# EAGLE design 6xLED_Panel (EAGLE 9.6.2)
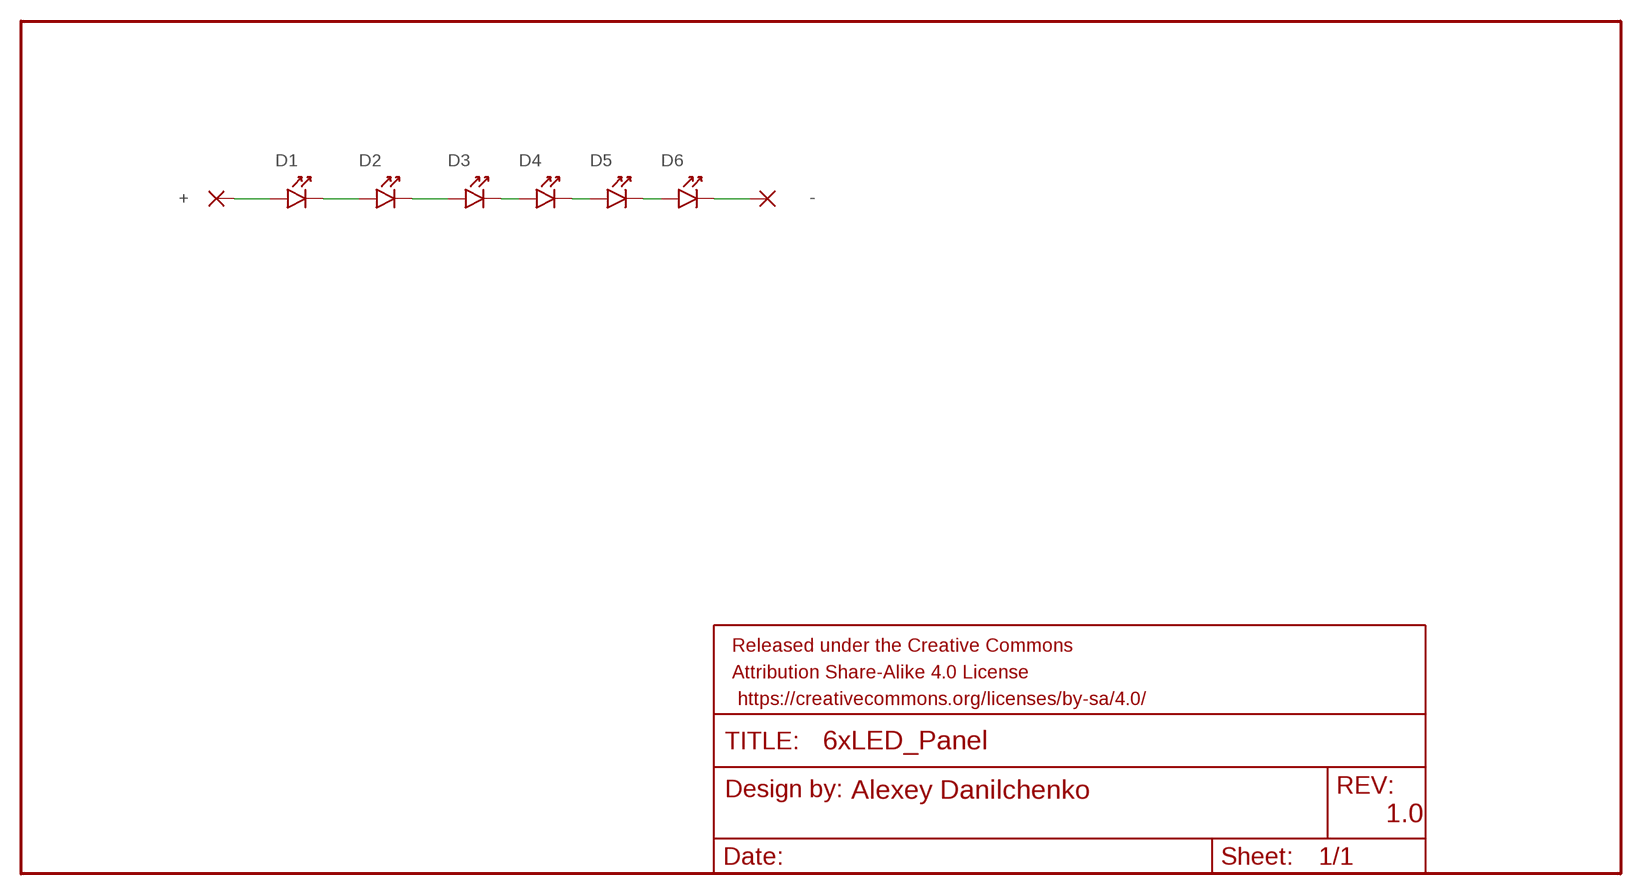
[diagram p0: schematic, sheet 1]

## Parts
+  WIREPAD1,6/0,9  2,15/1,0  [2,15/1,0]
-  2,15/1,0  [2,15/1,0]
D1  YUJI_2835_SMD  [2835_SMD]
D2  YUJI_2835_SMD  [2835_SMD]
D3  YUJI_2835_SMD  [2835_SMD]
D4  YUJI_2835_SMD  [2835_SMD]
D5  YUJI_2835_SMD  [2835_SMD]
D6  YUJI_2835_SMD  [2835_SMD]
FRAME1  FRAME-LEDGER  [CREATIVE_COMMONS]

## Nets
N$1: D1.CATHODE D2.ANODE
N$2: +.1(P) D1.ANODE
N$3: D2.CATHODE D3.ANODE
N$4: -.1(P) D6.CATHODE
N$9: D3.CATHODE D4.ANODE
N$10: D4.CATHODE D5.ANODE
N$11: D5.CATHODE D6.ANODE

## Library data of the parts
+ - = wirepad:2,15/1,0: THROUGH-HOLE PAD
D1-D6 = Yuji_LED:YUJI_2835_SMD
FRAME1 = SparkFun-Aesthetics:FRAME-LEDGER: Schematic Frame Standard 11x14 US Ledger frame; AUTHOR: Alexey Danilchenko; VER: 1.0

## Board
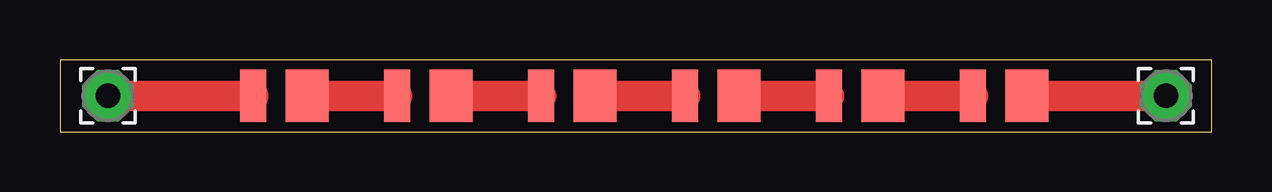
[diagram p1: board, top side]

Size 48 x 3 mm. Coordinates in mm from the lower left corner, seen from the top.
Outline: 0,0 48,0 48,3 0,3 0,0
Copper layers (1*16): Top 0.035mm / dielectric 1.5mm / Bottom 0.035mm
Design rules "default": minimum track width 10mil, minimum drill 24mil, track to track 8mil, track to pad 8mil, pad to pad 8mil, via to via 8mil, smd to smd 8mil, copper to edge 40mil, drill to drill 8mil, minimum pad ring 10mil, minimum via ring 8mil, stop-mask expansion 4mil, vias tented up to drill 0mil, thermal gap 10mil

### Footprints (pad centres in the part's own frame; a part is rotated, then mirrored left to right if it is on the bottom)
2,15/1,0 = drill 1.016 pad 2.159 octagon: 1 0,0
2835_SMD = smd 1.1 x 2.2: ANODE 0.95,0 | smd 1.8 x 2.2: CATHODE -1.3,0

### Placement (x,y rotation side)
+  2,1.5 270 top
-  46.1,1.5 90 top
D1  9,1.5 180 top
D2  15,1.5 180 top
D3  21,1.5 180 top
D4  27,1.5 180 top
D5  33,1.5 180 top
D6  39,1.5 180 top
FRAME1  0,0 0 top

### Tracks (layer width: path | path; a pad name or v marks a point on that pad's centre or on a via)
N$1
  Top 1.27: 10.31,1.31 D1.CATHODE D2.ANODE
N$2
  Top 1.27: +.1 D1.ANODE
N$3
  Top 1.27: D2.CATHODE D3.ANODE
N$4
  Top 1.27: D6.CATHODE -.1
N$9
  Top 1.27: D4.ANODE D3.CATHODE
N$10
  Top 1.27: D5.ANODE D4.CATHODE
N$11
  Top 1.27: D6.ANODE D5.CATHODE

### Text on the board
bNames: + | -